# Altium schematic sheet LoraThu.SchDoc
size A0
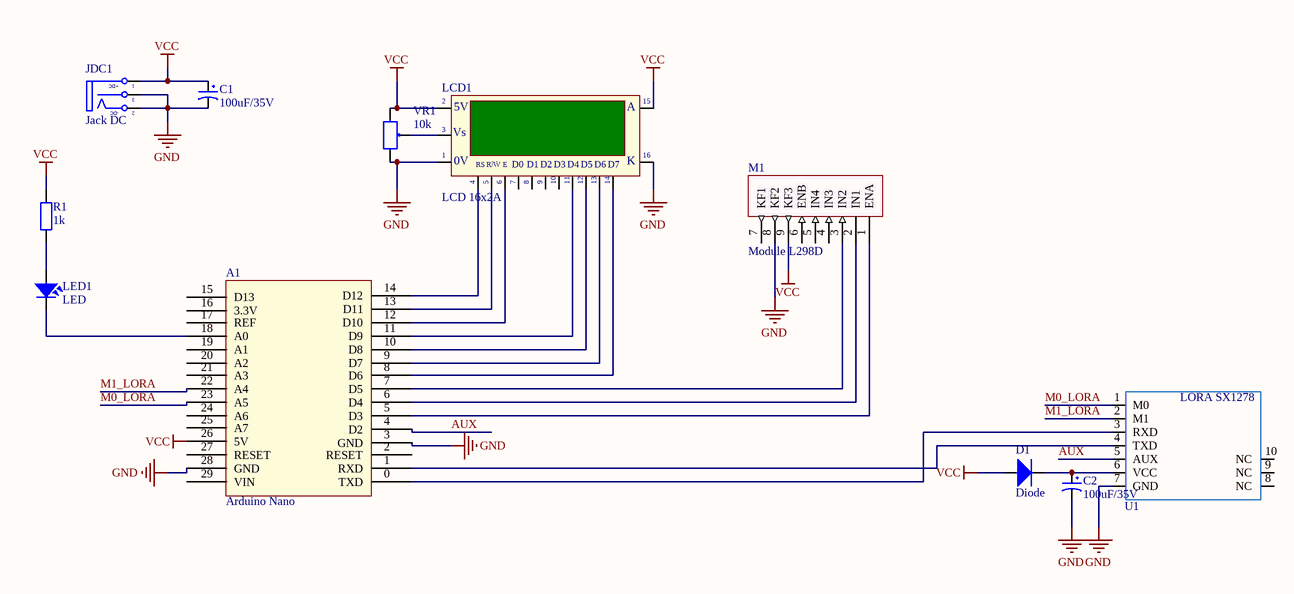
[diagram p0: LoraThu.SchDoc]

## Parts
A1  Arduino Nano  [Arduino Nano]
C1  100uF/35V  [CP1.5/3.4]
C2  100uF/35V  [CP1.5/3.4]
D1  Diode  [DIO-SMD-106]
JDC1  Jack DC  [CUI PJ-014D]
LCD1  LCD 16x2A  [LCD16X2N]
LED1  LED  [LED-3]
M1  Module L298D  [L298]
R1  1k  [RES-1/4W]
U1  Lora SX1278 UART  [Lora_uart_sx1278]  (value not drawn)
VR1  10k  [VR-S2]

## Nets
GND: A1.3(GND) A1.28(GND) C1.2 C2.2 JDC1.2(TN) JDC1.3(S) LCD1.1(GND) LCD1.16(K) M1.8(KF2) U1.7(GND) VR1.3
VCC: A1.26(5V) C1.1 D1.1 JDC1.1(T) LCD1.2(VDD) LCD1.15(A) M1.9(KF3) R1.2 VR1.1
AUX: A1.4(D2) U1.5(AUX)
M0_LORA: A1.23(A5) U1.1(M0)
M1_LORA: A1.22(A4) U1.2(M1)
NetA1_0: A1.0(TXD) U1.3(RXD)
NetA1_1: A1.1(RXD) U1.4(TXD)
NetA1_5: A1.5(D3) M1.1(ENA)
NetA1_6: A1.6(D4) M1.2(IN1)
NetA1_7: A1.7(D5) M1.3(IN2)
NetA1_8: A1.8(D6) LCD1.14(D7)
NetA1_9: A1.9(D7) LCD1.13(D6)
NetA1_10: A1.10(D8) LCD1.12(D5)
NetA1_11: A1.11(D9) LCD1.11(D4)
NetA1_12: A1.12(D10) LCD1.6(~{EN})
NetA1_13: A1.13(D11) LCD1.5(R/~{W})
NetA1_14: A1.14(D12) LCD1.4(RS)
NetA1_18: A1.18(A0) LED1.2
NetC2_1: C2.1 D1.2 U1.6(VCC)
NetLCD1_3: LCD1.3(VEE) VR1.2
NetLED1_1: LED1.1 R1.1

Not connected (* = marked no-connect by the designer): A1 2(RESET) 15(D13) 16(3.3V) 17(REF) 19(A1) 20(A2) 21(A3) 24(A6) 25(A7) 27(RESET) 29(VIN); LCD1 7(D0) 8(D1) 9(D2) 10(D3); M1 4(IN3) 5(IN4) 6(ENB) 7(KF1); U1 8(NC) 9(NC) 10(NC)

## Notes on the sheet
- (in symbol JACK_DC) +DC; -DC
- (in symbol LCD16x2A) 5V; Vs; |; 0V; R/W; E
- (in symbol Lora SX1278 UART) LORA SX1278

## Library data of the parts
C1 C2 = CP3: Cap 100uF/35V - 470uF/16V; Value: 100uF/35V/50V; Description 1: 1000uF/6,3V - 470uF/16V - 330uF - 25V; Description 2: 220uF/35V - 100uF/50V - 63V - 4,7uF/200V; Description 3: 22uF => 33uF100V - 3,3uF => 4,7uF/250V; Description 4: 2,2uF =>3,3uF/350 - 2,2uF/400V - 1uF/450V
JDC1 = JACK_DC
LCD1 = LCD16x2A: LCD dipslay 16 char, 2 line; Value: LCD16x2A
R1 = R: Resistor R1/4W
VR1 = Resistor Var